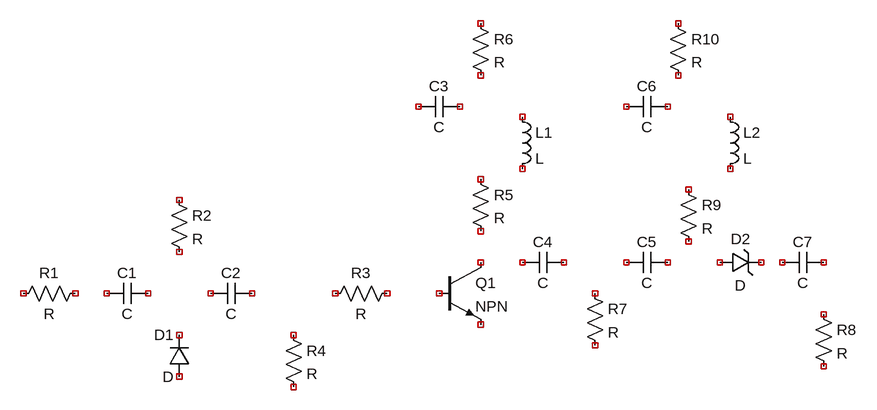
[diagram p0: schematic Draft1.asc]
Draft1.asc, the LTspice schematic file:
Version 4
SHEET 1 1192 680
SYMBOL cap 96 144 R90
WINDOW 0 0 32 VBottom 2
WINDOW 3 32 32 VTop 2
SYMATTR InstName C1
SYMBOL cap 256 144 R90
WINDOW 0 0 32 VBottom 2
WINDOW 3 32 32 VTop 2
SYMATTR InstName C2
SYMBOL res 0 144 R90
WINDOW 0 0 56 VBottom 2
WINDOW 3 32 56 VTop 2
SYMATTR InstName R1
SYMBOL res 128 0 R0
SYMATTR InstName R2
SYMBOL res 480 144 R90
WINDOW 0 0 56 VBottom 2
WINDOW 3 32 56 VTop 2
SYMATTR InstName R3
SYMBOL res 304 208 R0
SYMATTR InstName R4
SYMBOL npn 544 112 R0
SYMATTR InstName Q1
SYMBOL cap 576 -144 R90
WINDOW 0 0 32 VBottom 2
WINDOW 3 32 32 VTop 2
SYMATTR InstName C3
SYMBOL ind 656 -128 R0
SYMATTR InstName L1
SYMBOL res 592 -32 R0
SYMATTR InstName R5
SYMBOL res 592 -272 R0
SYMATTR InstName R6
SYMBOL cap 736 96 R90
WINDOW 0 0 32 VBottom 2
WINDOW 3 32 32 VTop 2
SYMATTR InstName C4
SYMBOL res 768 144 R0
SYMATTR InstName R7
SYMBOL cap 896 96 R90
WINDOW 0 0 32 VBottom 2
WINDOW 3 32 32 VTop 2
SYMATTR InstName C5
SYMBOL diode 160 288 R180
WINDOW 0 24 64 Left 2
WINDOW 3 24 0 Left 2
SYMATTR InstName D1
SYMBOL zener 976 128 R270
WINDOW 0 36 32 VTop 2
WINDOW 3 -4 32 VBottom 2
SYMATTR InstName D2
SYMBOL res 1120 176 R0
SYMATTR InstName R8
SYMBOL res 912 -16 R0
SYMATTR InstName R9
SYMBOL ind 976 -128 R0
SYMATTR InstName L2
SYMBOL cap 896 -144 R90
WINDOW 0 0 32 VBottom 2
WINDOW 3 32 32 VTop 2
SYMATTR InstName C6
SYMBOL cap 1136 96 R90
WINDOW 0 0 32 VBottom 2
WINDOW 3 32 32 VTop 2
SYMATTR InstName C7
SYMBOL res 896 -272 R0
SYMATTR InstName R10

The netlist it stands for:
* Draft1.asc
C1 NC_01 NC_02 C
C2 NC_03 NC_04 C
R1 NC_05 NC_06 R
R2 NC_07 NC_08 R
R3 NC_09 NC_10 R
R4 NC_11 NC_12 R
Q1 NC_13 NC_14 NC_15 0 NPN
C3 NC_16 NC_17 C
L1 NC_18 NC_19 L
R5 NC_20 NC_21 R
R6 NC_22 NC_23 R
C4 NC_24 NC_25 C
R7 NC_26 NC_27 R
C5 NC_28 NC_29 C
D1 NC_30 NC_31 D
D2 NC_32 NC_33 D
R8 NC_34 NC_35 R
R9 NC_36 NC_37 R
L2 NC_38 NC_39 L
C6 NC_40 NC_41 C
C7 NC_42 NC_43 C
R10 NC_44 NC_45 R
.model D D
.lib standard.dio
.model NPN NPN
.model PNP PNP
.lib standard.bjt
.backanno
.end